# EAGLE design Camara_V4_LOCK (EAGLE 7.6.0)
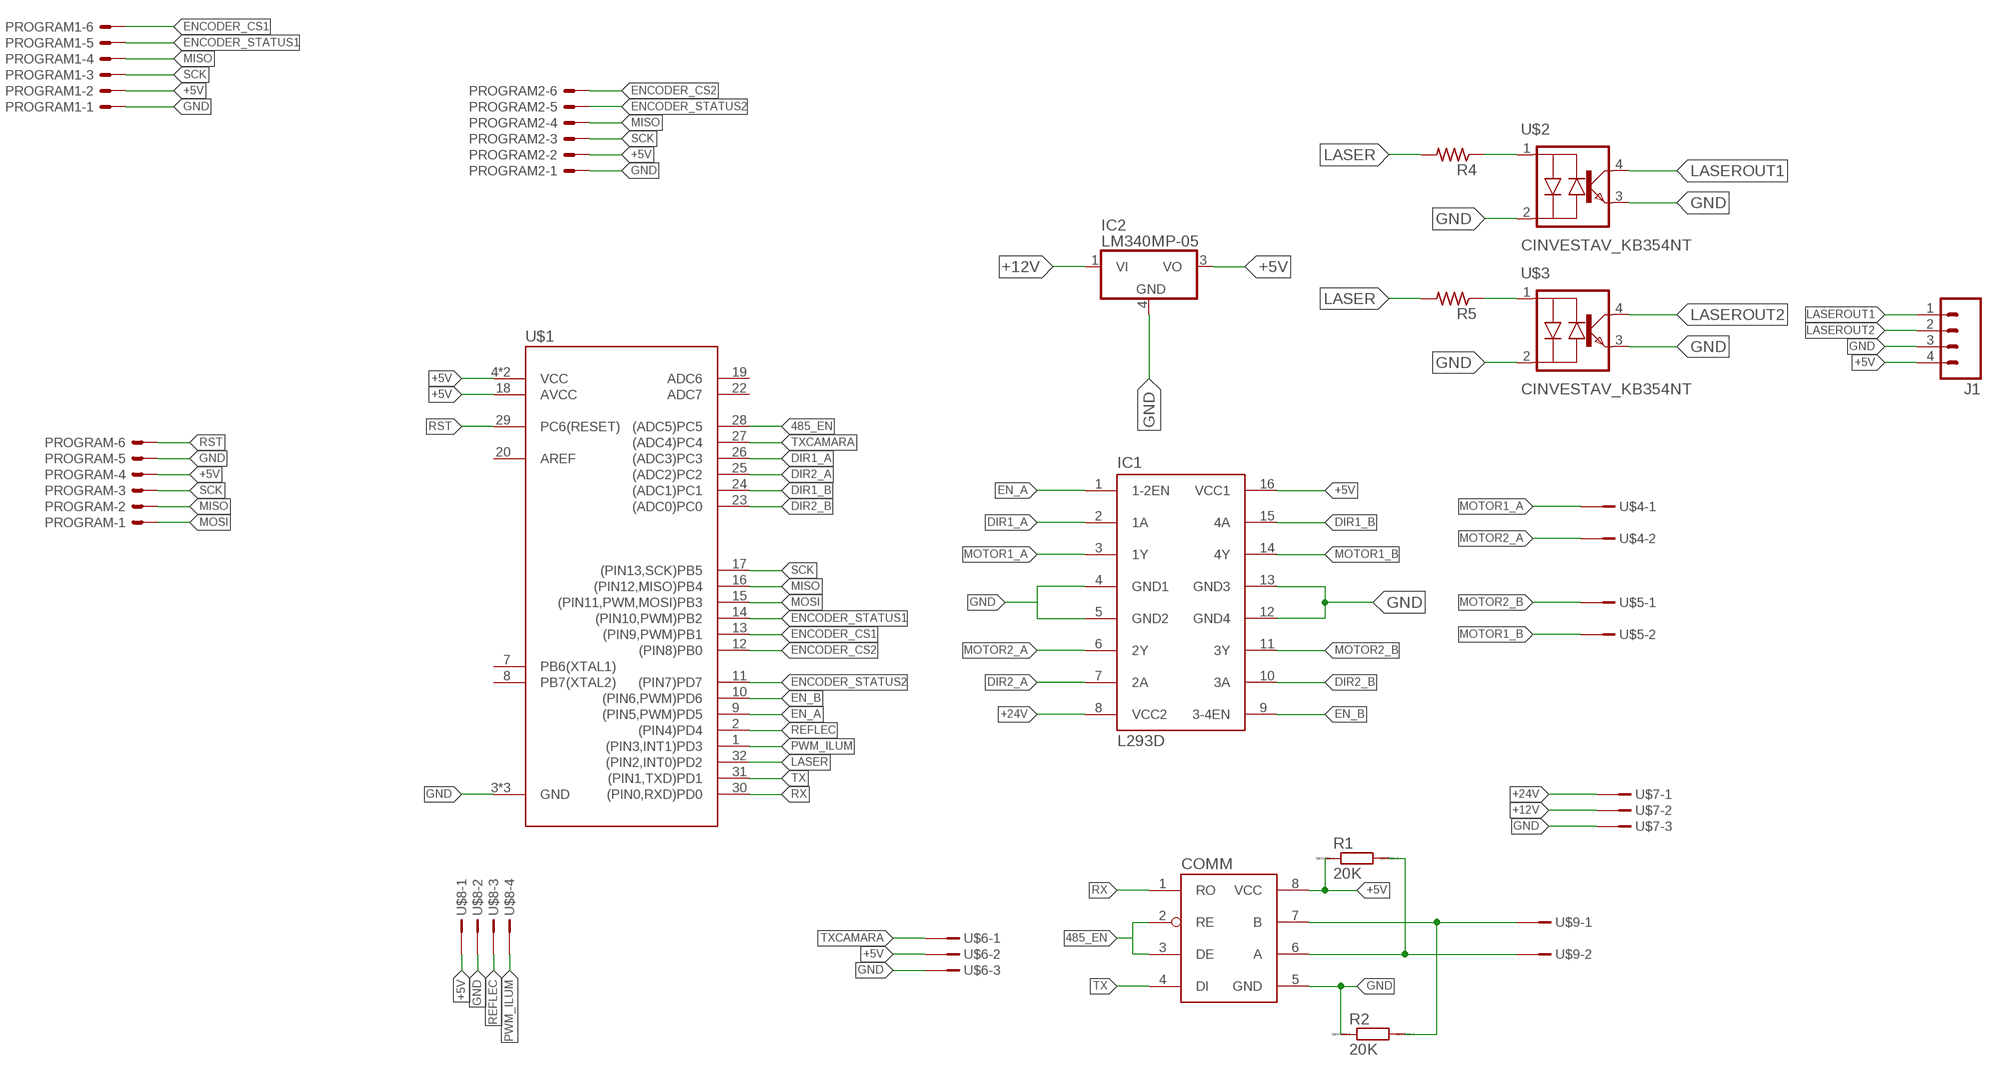
[diagram p0: schematic, sheet 1]

## Parts
COMM  CINVESTAV_ADM1485  [CINVESTAV_SOIC8]
IC1  L293D  [DIL16]
IC2  LM340MP-05  [SOT223]
J1  M04JST-PTH-VERT  [JST-4-PTH-VERT]
PROGRAM  22-23-2061  [22-23-2061]
PROGRAM1  22-23-2061  [22-23-2061]
PROGRAM2  22-23-2061  [22-23-2061]
R1  20K  RR1206  [R1206]
R2  20K  RR1206  [R1206]
R4  R-US_M1206  [M1206]
R5  R-US_M1206  [M1206]
U$1  CINVESTAV_ATMEGA328  [CINVESTAV_TQFP32-08]
U$2  CINVESTAV_KB354NT  [CINVESTAV_SOIC4]
U$3  CINVESTAV_KB354NT  [CINVESTAV_SOIC4]
U$4  XH-02  [XH-02]
U$5  XH-02  [XH-02]
U$6  XH-03  [XH-03]
U$7  XH-03  [XH-03]
U$8  XH-04  [XH-04]
U$9  XH-02  [XH-02]

## Nets
485_EN: COMM.2(RE) COMM.3(DE) U$1.28((ADC5)PC5)
+5V: COMM.8(VCC) IC1.16(VCC1) IC2.3(VO) J1.4 PROGRAM1.2 PROGRAM2.2 PROGRAM.4 R1.1 U$1.4(VCC) U$1.6(VCC) U$1.18(AVCC) U$6.P$2 U$8.P$1
+12V: IC2.1(VI) U$7.P$2
+24V: IC1.8(VCC2) U$7.P$1
DIR1_A: IC1.2(1A) U$1.26((ADC3)PC3)
DIR1_B: IC1.15(4A) U$1.24((ADC1)PC1)
DIR2_A: IC1.7(2A) U$1.25((ADC2)PC2)
DIR2_B: IC1.10(3A) U$1.23((ADC0)PC0)
EN_A: IC1.1(1-2EN) U$1.9((PIN5,PWM)PD5)
EN_B: IC1.9(3-4EN) U$1.10((PIN6,PWM)PD6)
ENCODER_CS1: PROGRAM1.6 U$1.13((PIN9,PWM)PB1)
ENCODER_CS2: PROGRAM2.6 U$1.12((PIN8)PB0)
ENCODER_STATUS1: PROGRAM1.5 U$1.14((PIN10,PWM)PB2)
ENCODER_STATUS2: PROGRAM2.5 U$1.11((PIN7)PD7)
GND: COMM.5(GND) IC1.4(GND1) IC1.5(GND2) IC1.12(GND4) IC1.13(GND3) IC2.4(GND) J1.3 PROGRAM1.1 PROGRAM2.1 PROGRAM.5 R2.1 U$1.3(GND) U$1.5(GND) U$1.21(GND) U$2.2(C/A) U$2.3(EMIT) U$3.2(C/A) U$3.3(EMIT) U$6.P$3 U$7.P$3 U$8.P$2
LASER: R4.2 R5.2 U$1.32((PIN2,INT0)PD2)
LASEROUT1: J1.1 U$2.4(COL)
LASEROUT2: J1.2 U$3.4(COL)
MISO: PROGRAM1.4 PROGRAM2.4 PROGRAM.2 U$1.16((PIN12,MISO)PB4)
MOSI: PROGRAM.1 U$1.15((PIN11,PWM,MOSI)PB3)
MOTOR1_A: IC1.3(1Y) U$4.P$1
MOTOR1_B: IC1.14(4Y) U$5.P$2
MOTOR2_A: IC1.6(2Y) U$4.P$2
MOTOR2_B: IC1.11(3Y) U$5.P$1
N$2: R4.1 U$2.1(A/C)
N$3: COMM.6(A) R1.2 U$9.P$2
N$4: COMM.7(B) R2.2 U$9.P$1
N$8: R5.1 U$3.1(A/C)
PWM_ILUM: U$1.1((PIN3,INT1)PD3) U$8.P$4
REFLEC: U$1.2((PIN4)PD4) U$8.P$3
RST: PROGRAM.6 U$1.29(PC6(RESET))
RX: COMM.1(RO) U$1.30((PIN0,RXD)PD0)
SCK: PROGRAM1.3 PROGRAM2.3 PROGRAM.3 U$1.17((PIN13,SCK)PB5)
TX: COMM.4(DI) U$1.31((PIN1,TXD)PD1)
TXCAMARA: U$1.27((ADC4)PC4) U$6.P$1
Unconnected: U$1.7(PB6(XTAL1)) U$1.8(PB7(XTAL2)) U$1.19(ADC6) U$1.20(AREF) U$1.22(ADC7)

## Library data of the parts
COMM = VUG:CINVESTAV_ADM1485: ADM1485: Low power RS-1485 Transceiver
IC1 = st-microelectronics:L293D: PUSH-PULL 4 CHANNEL DRIVER; MPN: L293D; OC_FARNELL: 9589619; OC_NEWARK: 56P8249
IC2 = linear:LM340?-*: Positive VOLTAGE REGULATOR Source: http://cache.national.com/ds/LM/LM340.pdf
J1 = SparkFun-Connectors:M04: Header 4 Standard 4-pin 0.1" header. Use with straight break away headers (SKU : PRT-00116), right angle break away headers (PRT-00553), swiss pins (PRT-00743), machine pins (PRT-00117), and female headers (PRT-00115). Molex polarized connector foot print use with SKU : PRT-08231 with associated crimp pins and housings. 1MM SMD Version SKU: PRT-10208; PROD_ID: CONN-13251
PROGRAM PROGRAM1 PROGRAM2 = con-molex:22-23-2061: .100" (2.54mm) Center Header - 6 Pin; MF: MOLEX; MPN: 22-23-2061; OC_FARNELL: 1462922; OC_NEWARK: 27C1933
R1 R2 = eagle-ltspice:R: RESISTOR, European symbol; SPICEMODEL: NONE; SPICEPREFIX: R
R4 R5 = resistor:R-US_: RESISTOR, American symbol
U$1 = VUG:CINVESTAV_ATMEGA328: Atmega328 13 Entradas Digitales 7 Entradas Análogicas 6 PWM
U$2 U$3 = VUG:CINVESTAV_KB354NT
U$4 U$5 U$9 = con-jst:XH-02
U$6 U$7 = con-jst:XH-03
U$8 = con-jst:XH-04

## Board
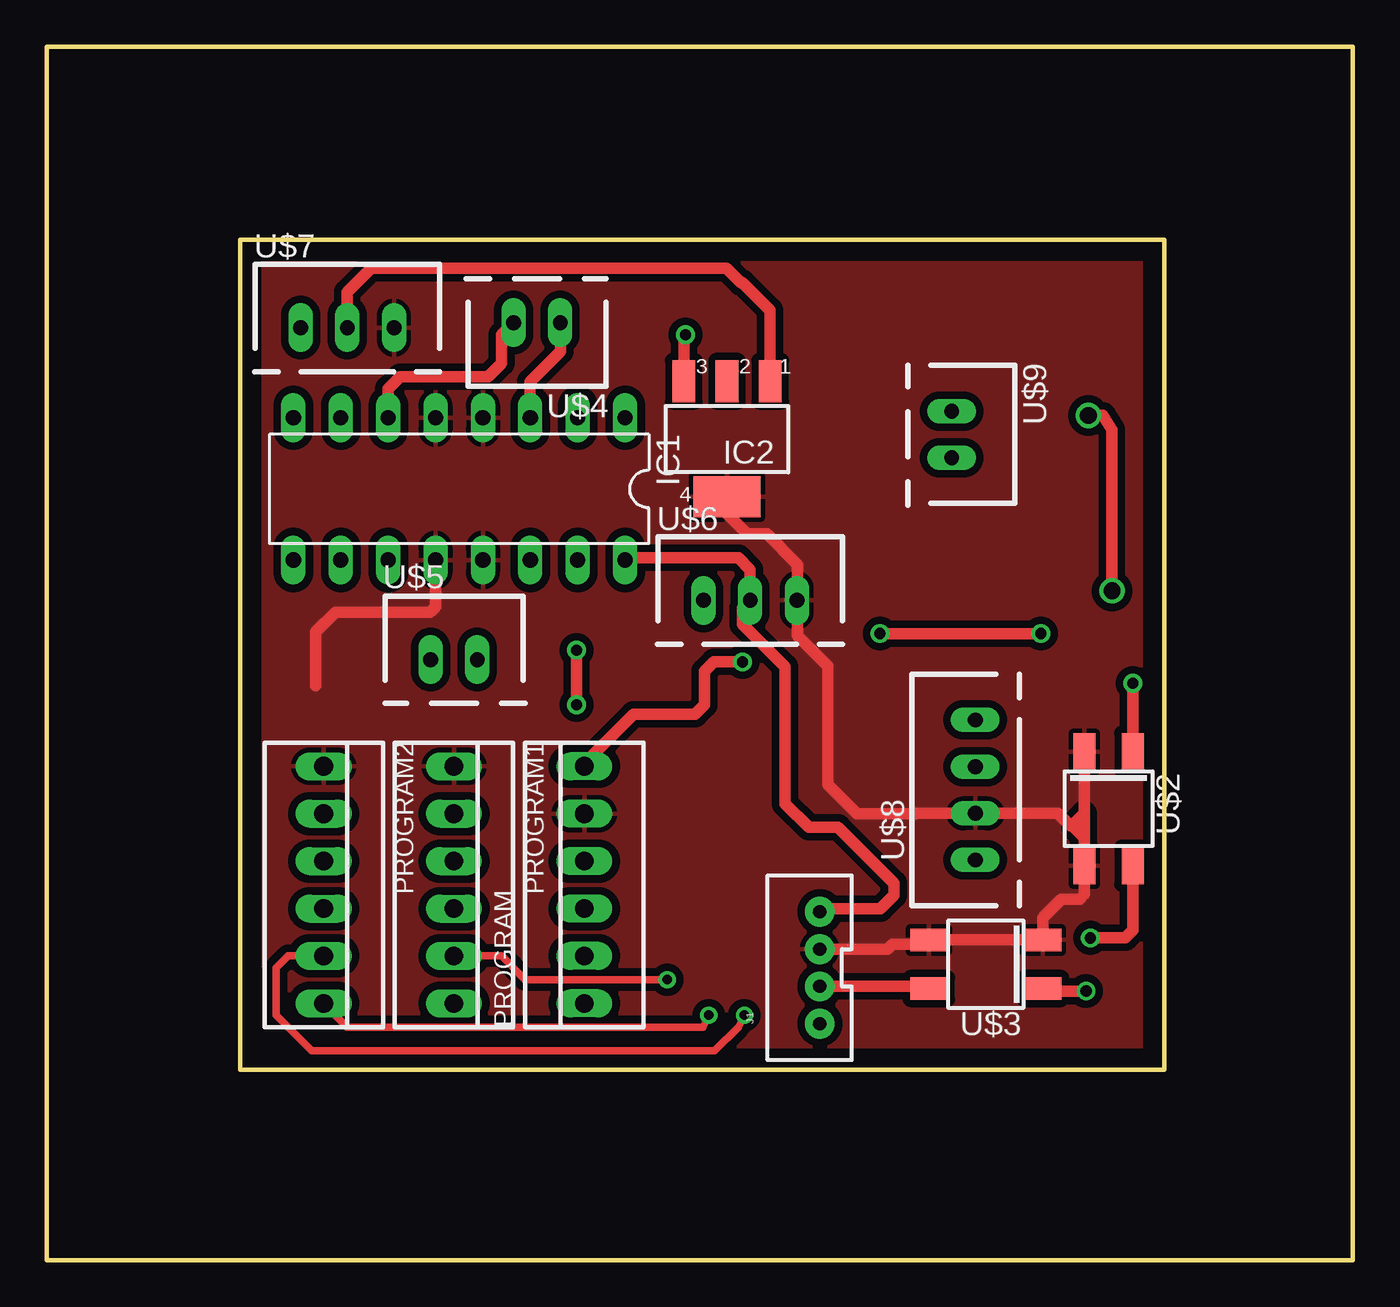
[diagram p1: board, top side]
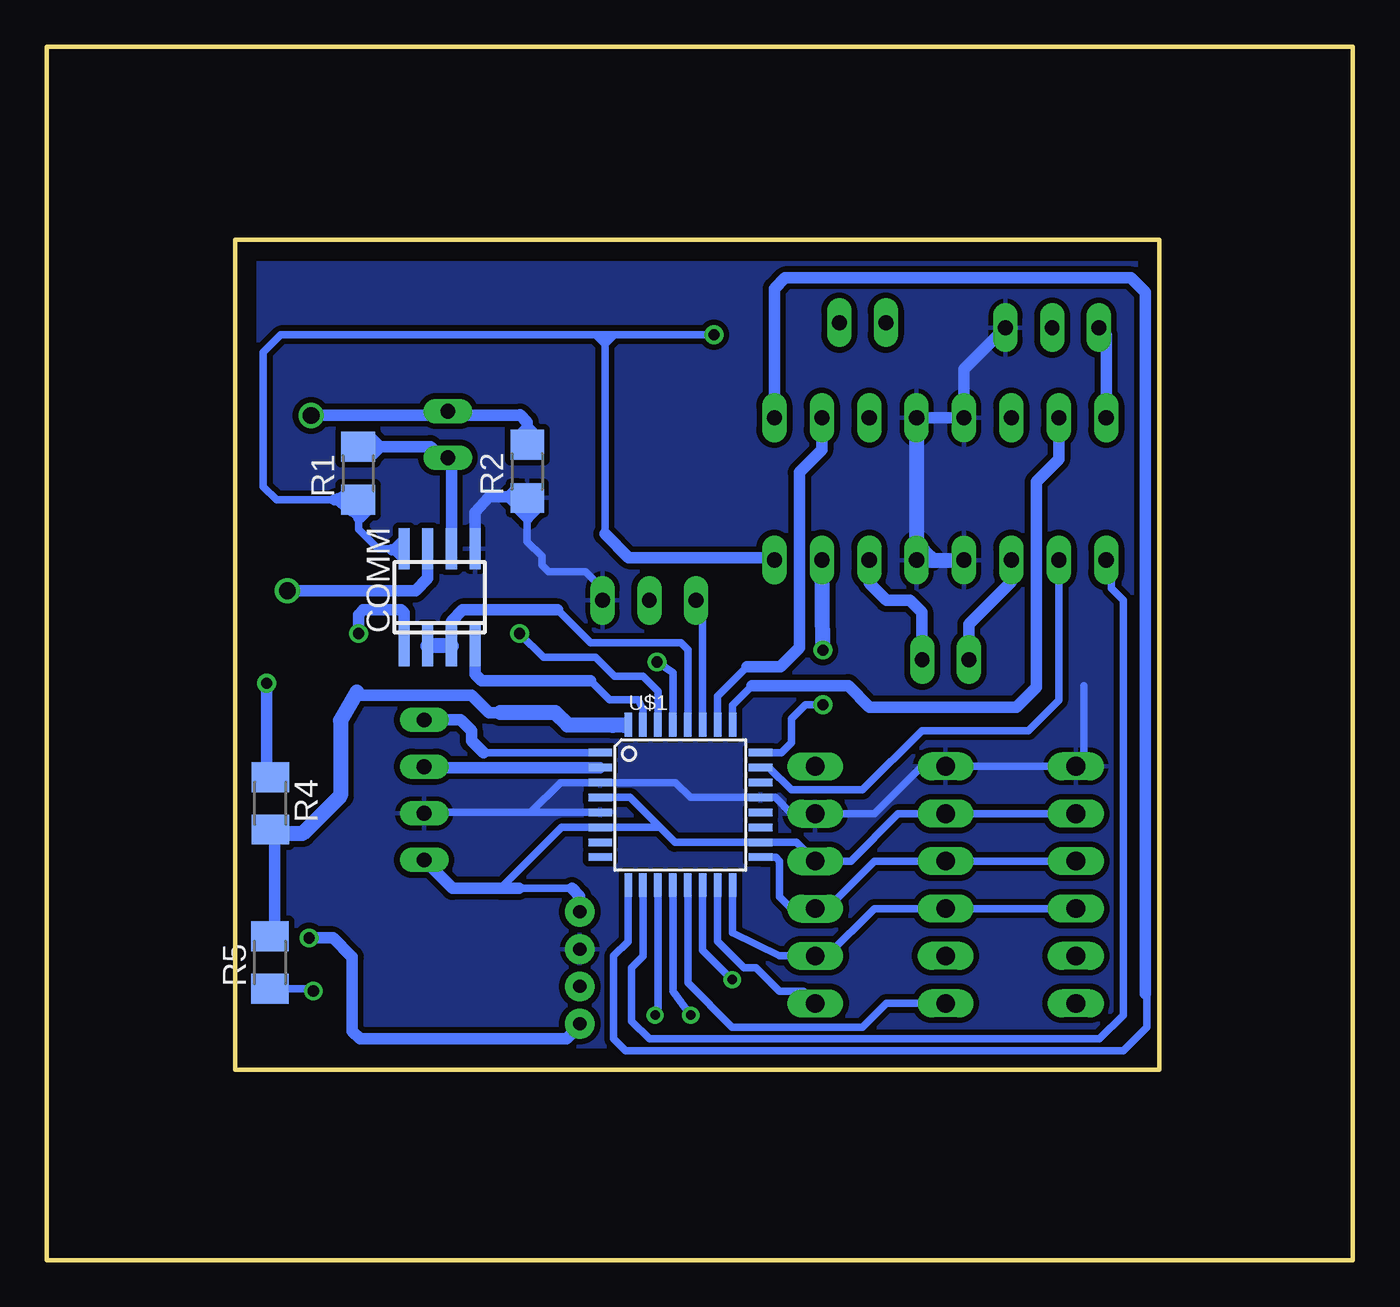
[diagram p2: board, bottom side, seen from below]

Size 70 x 65 mm. Coordinates in mm from the lower left corner, seen from the top.
Outline: 10.36,54.64 59.89,54.64 59.89,10.19 10.36,10.19 10.36,54.64
Outline: 0,0 0,65 70,65 70,0 0,0
Copper layers (1*16): Top 0.035mm / dielectric 1.5mm / Bottom 0.035mm
Design rules "default": minimum track width 10mil, minimum drill 24mil, track to track 8mil, track to pad 8mil, pad to pad 8mil, via to via 8mil, smd to smd 8mil, copper to edge 40mil, drill to drill 8mil, minimum pad ring 10mil, minimum via ring 8mil, stop-mask expansion 4mil, vias tented up to drill 0mil, thermal gap 10mil

### Footprints (pad centres in the part's own frame; a part is rotated, then mirrored left to right if it is on the bottom)
CINVESTAV_SOIC8 = smd 0.6 x 2.2: 1 -1.905,-2.6; 2 -0.635,-2.6; 3 0.635,-2.6; 4 1.905,-2.6; 5 1.905,2.6; 6 0.635,2.6; 7 -0.635,2.6; 8 -1.905,2.6
DIL16 = drill 0.813 long: 1 -8.89,-3.81; 2 -6.35,-3.81; 3 -3.81,-3.81; 4 -1.27,-3.81; 5 1.27,-3.81; 6 3.81,-3.81; 7 6.35,-3.81; 8 8.89,-3.81; 9 8.89,3.81; 10 6.35,3.81; 11 3.81,3.81; 12 1.27,3.81; 13 -1.27,3.81; 14 -3.81,3.81; 15 -6.35,3.81; 16 -8.89,3.81
SOT223 = smd 1.219 x 2.235: 1 -2.311,-3.099; 2 0,-3.099; 3 2.311,-3.099 | smd 3.6 x 2.2: 4 0,3.099
JST-4-PTH-VERT = drill 0.7 pad 1.6: 1 -3,-0.55; 2 -1,-0.55; 3 1,-0.55; 4 3,-0.55
22-23-2061 = drill 1 long: 1 -6.35,0; 2 -3.81,0; 3 -1.27,0; 4 1.27,0; 5 3.81,0; 6 6.35,0
R1206 = smd 1.6 x 1.803: 1 -1.422,0; 2 1.422,0
M1206 = smd 1.6 x 2: 1 -1.4,0; 2 1.4,0
CINVESTAV_TQFP32-08 = smd 1.27 x 0.4: 1 -4.293,2.8; 2 -4.293,2; 3 -4.293,1.2; 4 -4.293,0.4; 5 -4.293,-0.4; 6 -4.293,-1.2; 7 -4.293,-2; 8 -4.293,-2.8; 17 4.293,-2.8; 18 4.293,-2; 19 4.293,-1.2; 20 4.293,-0.4; 21 4.293,0.4; 22 4.293,1.2; 23 4.293,2; 24 4.293,2.8 | smd 0.4 x 1.27: 9 -2.8,-4.293; 10 -2,-4.293; 11 -1.2,-4.293; 12 -0.4,-4.293; 13 0.4,-4.293; 14 1.2,-4.293; 15 2,-4.293; 16 2.8,-4.293; 25 2.8,4.293; 26 2,4.293; 27 1.2,4.293; 28 0.4,4.293; 29 -0.4,4.293; 30 -1.2,4.293; 31 -2,4.293; 32 -2.8,4.293
CINVESTAV_SOIC4 = smd 2 x 1.2: 1 -3.05,1.3; 2 -3.05,-1.3; 3 3.05,-1.3; 4 3.05,1.3
XH-02 = drill 0.8 long: P$1 -1.25,0; P$2 1.25,0
XH-03 = drill 0.8 long: P$1 -2.5,0; P$2 0,0; P$3 2.5,0
XH-04 = drill 0.8 long: P$1 -3.75,0; P$2 -1.25,0; P$3 1.25,0; P$4 3.75,0

### Placement (x,y rotation side)
COMM  48.94,35.51 0 bottom
IC1  22.11,41.31 180 top
IC2  36.46,43.98 180 top
J1  40.88,15.66 90 top
PROGRAM  28.82,20.1 90 top
PROGRAM1  21.83,20.1 270 top
PROGRAM2  14.84,20.1 270 top
R1  53.31,42.15 90 bottom
R2  44.25,42.24 90 bottom
R4  58.01,24.47 270 bottom
R5  58.04,15.94 90 bottom
U$1  36.04,24.38 0 bottom
U$2  56.91,24.17 270 top
U$3  50.33,15.84 180 top
U$4  26.27,50.22 180 top
U$5  21.83,32.16 0 top
U$6  37.7,35.34 0 top
U$7  16.12,49.95 0 top
U$8  49.77,25.18 90 top
U$9  48.5,44.23 270 top

### Tracks (layer width: path | path; a pad name or v marks a point on that pad's centre or on a via)
485_EN
  Bottom 0.406: U$1.28 35.64,32.68 36.02,33.05 40.84,33.05 42.62,34.83
  Bottom 0.61: 42.62,34.83 47.7,34.83 48.31,34.22 COMM.3
  Bottom 0.813: COMM.3 COMM.2
+5V  (via drill 0.6)
  Top 0.406: 31.13,37.63 IC1.16 | 34.15,49.48 v34.24,49.56
  Top 0.61: 31.13,37.63 37.07,37.63 37.7,36.99 U$6.P$2 37.29,34.92 37.29,34.07 39.57,31.78 39.57,24.45 40.84,23.18 42.4,23.18 45.4,20.18 45.4,19.54 44.69,18.83 41.61,18.83 J1.4 | IC2.3 34.15,49.48
  Bottom 0.406: 37.13,23.18 36.34,22.38 U$1.18 29.82,22.38 PROGRAM.4 26.91,21.37 24.37,23.91 PROGRAM1.2 PROGRAM2.2 | 37.13,23.18 U$1.6 | U$1.4 38.73,24.78 37.13,23.18 | U$1.6 | COMM.8 52.24,38.11 53.29,39.15 53.29,40.71 R1.1 | 40.08,38.9 40.08,49.06 | 40.08,49.06 40.08,49.56 | v34.24,49.56 39.57,49.56 | 39.57,49.56 40.08,49.56 | 40.08,49.56 40.59,49.56 | 40.59,49.56 57.45,49.56 58.39,48.62 58.39,41.44 57.68,40.73 54.56,40.73 53.95,41.13 | 54.05,40.73 53.97,40.65 | 45.41,19.91 44.69,19.91 41.84,19.91 | U$1.6 42.4,23.18 45.67,19.91 | 39.57,49.56 40.08,49.06 | 40.08,49.06 40.59,49.56
  Bottom 0.61: 40.08,38.9 38.81,37.63 31.13,37.63 IC1.16 | 54.56,40.73 54.05,40.73 | 53.97,40.65 53.39,40.65 R1.1 | J1.4 41.43,19.49 41.84,19.91 | U$8.P$1 48.25,19.91 45.67,19.91 44.69,19.91
+12V
  Top 0.61: IC2.1 38.77,50.87 37.29,52.36 37.2,52.36 36.44,53.12 17.38,53.12 16.12,51.85 U$7.P$2
+24V
  Bottom 0.61: IC1.8 13.22,49.55 U$7.P$1
DIR1_A
  Bottom 0.406: U$1.26 34.04,30.2 32.46,31.78
  Bottom 0.61: 32.46,31.78 30.68,31.78 29.67,32.8 29.67,42.2 28.46,43.4 IC1.2
DIR1_B  (via drill 0.6)
  Top 0.61: v28.4,29.75 v28.4,32.67
  Bottom 0.406: v28.4,29.75 29.32,29.75 30.09,28.99 30.09,27.72 30.63,27.18 U$1.24
  Bottom 0.813: v28.4,32.67 IC1.15
DIR2_A
  Bottom 0.406: U$1.25 33.24,29.73 32.21,30.77
  Bottom 0.61: IC1.7 15.76,42.9 16.97,41.69 16.97,30.68 18.02,29.62 25.89,29.62 27.04,30.77 32.21,30.77
DIR2_B
  Bottom 0.406: U$1.23 31.28,26.38 30.09,25.18 26.27,25.18 23.1,28.36 17.38,28.36 15.76,29.98 IC1.10
EN_A
  Bottom 0.406: U$1.9 38.84,17.06 39.61,16.29 39.61,11.85 38.98,11.21 12.3,11.21 11.04,12.48 11.04,14.17 11.12,14.26
  Bottom 0.61: IC1.1 31,52.04 30.43,52.61 11.89,52.61 11.12,51.85 11.12,14.26
EN_B
  Bottom 0.406: 38.04,17.82 U$1.10 38.04,16.27 38.66,15.66 38.66,12.8 37.7,11.85 13.57,11.85 12.3,13.12 12.3,35.34 12.94,35.98 12.94,37.22 IC1.9
  Bottom 0.61: 13.16,37.44 IC1.9
ENCODER_CS1
  Bottom 0.406: U$1.13 35.64,14.86 33.26,12.48 26.27,12.48 25.01,13.75 PROGRAM1.6
ENCODER_CS2  (via drill 0.51)
  Top 0.406: v35.48,13.12 35.16,12.48 16.12,12.48 PROGRAM2.6
  Bottom 0.406: U$1.12 36.44,15.65 36.44,15.02 36.44,14.38 v35.48,13.12
ENCODER_STATUS1  (via drill 0.51)
  Top 0.406: v33.26,15.02 25.64,15.02 24.37,16.29 PROGRAM1.5
  Bottom 0.406: U$1.14 34.84,16.6 v33.26,15.02
ENCODER_STATUS2  (via drill 0.51)
  Top 0.406: v37.39,13.12 37.07,12.48 35.8,11.21 14.21,11.21 12.3,13.12 12.3,15.66 12.94,16.29 PROGRAM2.5
  Bottom 0.406: U$1.11 37.24,13.26 v37.39,13.12
GND
  Top 0.406: IC2.4 36.46,39.98 | 55.62,21.11 U$2.3 | 55.38,23.3 55.61,23.07
  Top 0.61: 36.46,39.98 37.54,38.9 38.59,38.9 40.25,37.25 40.25,35.38 U$6.P$3 40.25,35.3 40.25,33.44 41.88,31.8 41.88,25.45 43.42,23.91 46.59,23.91 46.62,23.93 U$8.P$2 54.2,23.93 54.85,23.27 55.36,23.27 55.38,23.3 | 55.62,21.11 55.62,19.59 55.37,19.34 54.38,19.34 53.38,18.34 U$3.2 U$3.3 47.06,16.93 45.33,16.93 45.05,16.66 J1.3 | U$2.3 55.61,23.07 U$2.2 | 14.43,30.77 14.43,33.65 15.48,34.7 20.56,34.7 20.84,34.98 IC1.12
  Bottom 0.406: U$1.5 44.05,23.98 | 23.32,45.18 IC1.4 | 44.27,40.88 R2.1 44.25,38.49 43.46,37.7 43.46,37.22 43.1,36.86 41.12,36.86 40.46,36.2 40.46,35.72 U$6.P$3 | 14.43,30.77 14.43,26.87 PROGRAM2.1 PROGRAM1.1 23.1,26.45 25.64,23.91 PROGRAM.5 30.09,23.91 30.95,24.78 U$1.21 35.49,24.78 36.29,25.58 U$1.3 42.45,25.58 44.05,23.98 | 44.05,23.98 49.72,23.98 U$8.P$2
  Bottom 0.61: IC1.4 IC1.5 20.84,47.72 U$7.P$3 | COMM.5 47.04,40.07 46.3,40.88 44.27,40.88
  Bottom 0.813: IC1.4 IC1.13 IC1.12
  pour Bottom (isolate 0.305): 10,10 10,55 60,55 60,10
  pour Top (isolate 0.406): 10,10 61,10 61,55 10,55
LASER
  Bottom 0.254: U$1.32 39.36,28.67 39.37,28.66
  Bottom 0.406: 57.79,22.84 R4.2 | 57.79,17.59 R5.2
  Bottom 0.61: 57.79,22.84 57.79,17.59 | 45.69,29.32 46.29,29.32 47.23,30.26 53.19,30.26 53.36,30.44
  Bottom 0.813: 45.69,29.32 42.75,29.32 42.1,28.67 39.38,28.67 39.37,28.66 | 53.36,30.44 54.25,28.91 54.25,24.88 56.28,22.84 57.79,22.84
LASEROUT1  (via drill 0.6)
  Top 0.61: v55.93,17.25 57.81,17.25 58.22,17.66 U$2.4
  Bottom 0.61: v55.93,17.25 54.66,17.25 53.64,16.24 53.62,16.24 53.62,12.25 53.21,11.85 42.15,11.85 41.43,12.56 J1.1
LASEROUT2
  Top 0.61: J1.2 47.17,14.66 U$3.4
MISO
  Bottom 0.406: PROGRAM2.4 PROGRAM1.4 25.64,18.83 28.18,16.29 PROGRAM.2 30.72,16.29 33.24,17.54 U$1.16
MOSI
  Bottom 0.406: U$1.15 34.04,17.07 32.62,15.66 31.99,15.66 30.72,14.38 29.45,14.38 PROGRAM.1
MOTOR1_A
  Top 0.61: IC1.3 25.92,47.05 27.55,48.67 27.55,51.2 U$4.P$1
MOTOR1_B
  Bottom 0.61: IC1.14 25.92,36.25 25.01,35.34 23.73,35.34 23.1,34.7 23.1,32.19 U$5.P$2
MOTOR2_A
  Top 0.61: IC1.6 18.29,46.67 18.95,47.33 23.66,47.33 24.37,48.04 24.37,49.56 U$4.P$2
MOTOR2_B
  Bottom 0.61: IC1.11 18.3,36.33 20.58,34.05 U$5.P$1
N$2  (via drill 0.6)
  Top 0.61: U$2.1 58.21,29.62 v58.22,30.89
  Bottom 0.406: 58.22,26.07 R4.1
  Bottom 0.61: v58.22,30.89 58.22,26.07
N$3
  Bottom 0.61: R1.2 49.43,43.57 48.84,42.98 U$9.P$2 48.31,42.79 COMM.6
N$4  (via drill 0.9)
  Top 0.61: v55.83,45.25 56.59,45.25 57.1,44.48 v57.1,35.85
  Bottom 0.406: 55.07,45.25 55.05,45.26 55.04,45.25 | 48.56,45.25 48.56,45.42
  Bottom 0.61: v55.83,45.25 55.07,45.25 | R2.2 44.25,44.89 44.63,45.27 44.65,45.25 48.56,45.25 55.04,45.25 | v57.1,35.85 50.24,35.85 49.58,36.51 COMM.7 | 48.56,45.42 U$9.P$1
N$8  (via drill 0.6)
  Top 0.406: 53.52,14.41 U$3.1
  Top 0.61: v55.7,14.41 53.52,14.41
  Bottom 0.406: R5.1 55.83,14.54 v55.7,14.41
N$28
  Bottom 0.406: 53.85,40.24 54.53,40.7
  Bottom 0.61: 53.82,40.24 53.85,40.24 | 53.85,40.24 53.9,40.24 | 54.38,40.75 53.85,40.24
N$29
  Bottom 0.61: 54.38,40.78 53.67,40.14
N$30
  Bottom 0.406: 51.36,38.21 50.9,38.67
N$31
  Bottom 0.406: 51.46,38.06 50.9,37.5
  Bottom 0.61: 51.48,38.06 51.46,38.06
N$32
  Bottom 0.61: 44.8,41.28 44.83,41.28 45.19,40.93 45.19,40.85 44.73,40.39
N$33
  Bottom 0.61: 44.17,39.81 44.17,39.84 43.79,40.22
N$34
  Bottom 0.61: 44.22,39.73 44.22,39.76 44.7,40.24
N$35
  Bottom 0.61: 52.65,44 52.65,43.98 52.3,43.62
N$36
  Bottom 0.61: 52.58,43.14 52.55,43.14 52.15,43.54
N$37
  Bottom 0.61: 52.09,43.57 52.15,43.57 52.6,44.03
N$38
  Bottom 0.61: 52.88,40.34 52.88,40.11 53.26,39.73
N$39
  Bottom 0.406: 53.82,40.24 53.36,39.78
  Bottom 0.61: 53.82,40.34 53.82,40.24
N$40
  Bottom 0.61: 23.29,38.26 23.29,37.96
  Bottom 0.813: 22.63,37.6 23.29,38.26
N$47
  Bottom 0.61: 43.71,44.13 43.76,44.13 44.22,44.59 44.7,44.1
N$60
  Bottom 0.813: 39.04,28.63 39.67,28.63
N$61
  Bottom 0.813: 39.01,28.66 39.67,28.66
N$62
  Top 0.61: 55.07,23.4 55.57,23.91 55.57,22.64 55.07,23.15
PWM_ILUM
  Bottom 0.406: U$1.1 46.59,27.18
  Bottom 0.61: U$8.P$4 47.8,28.93 47.23,28.36 47.23,27.81 46.59,27.18
REFLEC
  Bottom 0.61: U$1.2 49.72,26.38 U$8.P$3
RST  (via drill 0.6)
  Top 0.61: v37.29,32.04 35.76,32.04 35.25,31.53 35.25,29.75 34.75,29.24 31.44,29.24 28.82,26.61 PROGRAM.6
  Bottom 0.406: U$1.29 36.44,31.45 v37.29,32.04
RX  (via drill 0.6)
  Top 0.61: v44.65,33.56 v53.29,33.56
  Bottom 0.406: U$1.30 37.24,30.47 38.05,31.28 39.57,31.28 40.59,32.29 43.38,32.29 v44.65,33.56
  Bottom 0.61: COMM.1 50.85,34.68 51,34.83 53.03,34.83 53.29,34.58 v53.29,33.56
SCK
  Bottom 0.406: U$1.17 30.93,21.58 30.72,21.37 30.72,19.46 30.09,18.83 PROGRAM.3 28.18,18.83 25.64,21.37 PROGRAM1.3 PROGRAM2.3
TX
  Bottom 0.406: 40.84,31.02 39.83,30.01 38.3,30.01 38.05,29.5 U$1.31
  Bottom 0.61: COMM.4 47.04,31.38 46.68,31.02 40.84,31.02
TXCAMARA
  Bottom 0.406: U$1.27 34.84,34.98 U$6.P$1